# Altium schematic sheet DSR4_MODULE.SchDoc: My title
size A3; Organization: University of California; Address1: 475 Portola Plaza; Address2: Los Angeles, CA 90095; Revision: R01; SheetNumber: 1; SheetTotal: 1
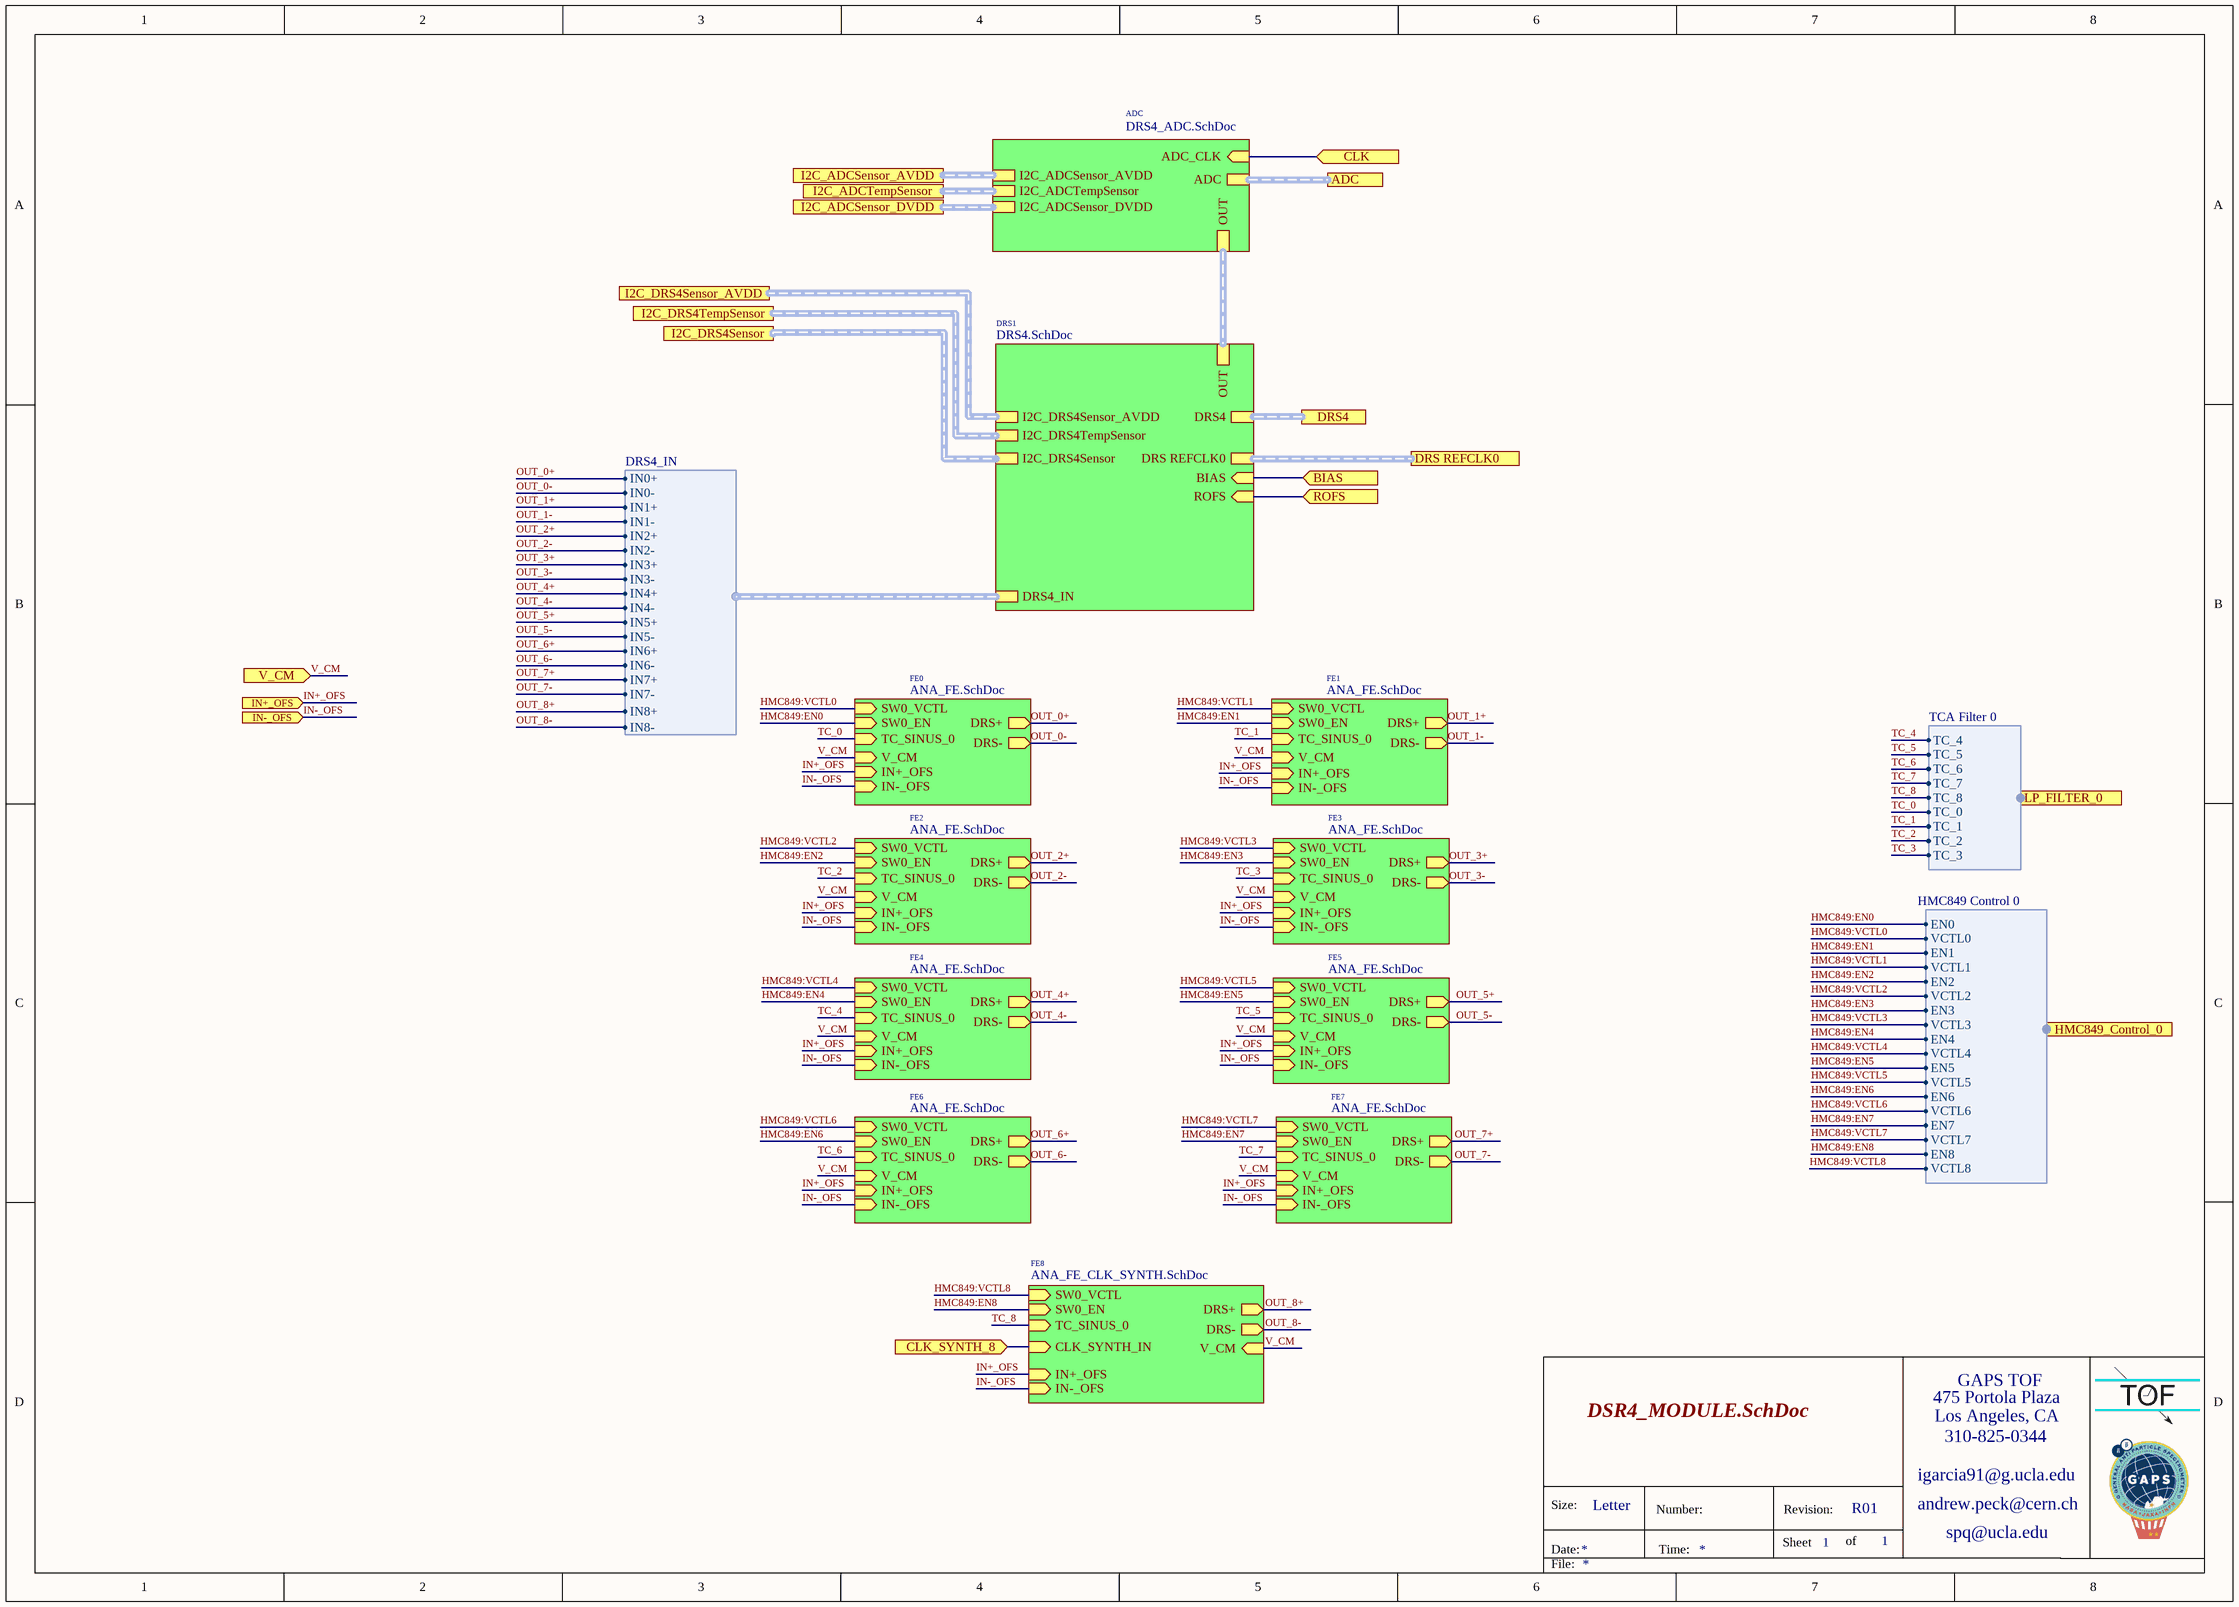
[diagram p0: DSR4_MODULE.SchDoc]

## Sub-sheets
ADC = DRS4_ADC.SchDoc: ADC (harness ADC), OUT (harness DRS4_OUT), ADC_CLK (in), I2C_ADCSensor_AVDD (harness ADC AVDD Current Sensor I2C), I2C_ADCTempSensor (harness ADC Temp Sensor I2C), I2C_ADCSensor_DVDD (harness ADC DVDD Current Sensor I2C)
DRS1 = DRS4.SchDoc: DRS4_IN (harness DRS4_IN), DRS4 (harness DRS4), OUT (harness DRS4_OUT), DRS REFCLK0 (harness DRS4 REFCLK0), BIAS (in), ROFS (in), I2C_DRS4TempSensor (harness DRS4 Temp Sensor I2C), I2C_DRS4Sensor (harness DRS4 Current Sensor I2C), I2C_DRS4Sensor_AVDD (harness DRS4 AVDD Current Sensor I2C)
FE0 = ANA_FE.SchDoc: DRS+ (out), DRS- (out), V_CM (in), SW0_VCTL (in), SW0_EN (in), TC_SINUS_0 (in), IN+_OFS (in), IN-_OFS (in)
FE1 = ANA_FE.SchDoc: DRS+ (out), DRS- (out), V_CM (in), SW0_VCTL (in), SW0_EN (in), TC_SINUS_0 (in), IN+_OFS (in), IN-_OFS (in)
FE2 = ANA_FE.SchDoc: DRS+ (out), DRS- (out), V_CM (in), SW0_VCTL (in), SW0_EN (in), TC_SINUS_0 (in), IN+_OFS (in), IN-_OFS (in)
FE3 = ANA_FE.SchDoc: DRS+ (out), DRS- (out), V_CM (in), SW0_VCTL (in), SW0_EN (in), TC_SINUS_0 (in), IN+_OFS (in), IN-_OFS (in)
FE4 = ANA_FE.SchDoc: DRS+ (out), DRS- (out), V_CM (in), SW0_VCTL (in), SW0_EN (in), TC_SINUS_0 (in), IN+_OFS (in), IN-_OFS (in)
FE5 = ANA_FE.SchDoc: DRS+ (out), DRS- (out), V_CM (in), SW0_VCTL (in), SW0_EN (in), TC_SINUS_0 (in), IN+_OFS (in), IN-_OFS (in)
FE6 = ANA_FE.SchDoc: DRS+ (out), DRS- (out), V_CM (in), SW0_VCTL (in), SW0_EN (in), TC_SINUS_0 (in), IN+_OFS (in), IN-_OFS (in)
FE7 = ANA_FE.SchDoc: DRS+ (out), DRS- (out), V_CM (in), SW0_VCTL (in), SW0_EN (in), TC_SINUS_0 (in), IN+_OFS (in), IN-_OFS (in)
FE8 = ANA_FE_CLK_SYNTH.SchDoc: DRS+ (out), DRS- (out), V_CM (in), SW0_VCTL (in), SW0_EN (in), TC_SINUS_0 (in), CLK_SYNTH_IN (in), IN+_OFS (in), IN-_OFS (in)

## Ports
ADC (harness ADC), BIAS (in), CLK (in), CLK_SYNTH_8 (in), DRS4 (harness DRS4_FPGA), DRS REFCLK0 (harness DRS4 REFCLK 0), HMC849_Control_0 (harness HMC849 Control 0), I2C_ADCSensor_AVDD (harness ADC AVDD Current Sensor I2C), I2C_ADCSensor_DVDD (harness ADC DVDD Current Sensor I2C), I2C_ADCTempSensor (harness ADC Temp Sensor I2C), I2C_DRS4Sensor (harness DRS4 Current Sensor I2C), I2C_DRS4Sensor_AVDD (harness DRS4 AVDD Current Sensor I2C), I2C_DRS4TempSensor (harness DRS4 Temp Sensor I2C), IN+_OFS (in), IN-_OFS (in), LP_FILTER_0 (harness TCA Filter 0), ROFS (in), V_CM (in)

## Harnesses
DRS4_IN: IN0+, IN0-, IN1+, IN1-, IN2+, IN2-, IN3+, IN3-, IN4+, IN4-, IN5+, IN5-, IN6+, IN6-, IN7+, IN7-, IN8+, IN8-
TCA Filter 0: TC_4, TC_5, TC_6, TC_7, TC_8, TC_0, TC_1, TC_2, TC_3
HMC849 Control 0: EN0, VCTL0, EN1, VCTL1, EN2, VCTL2, EN3, VCTL3, EN4, VCTL4, EN5, VCTL5, EN6, VCTL6, EN7, VCTL7, EN8, VCTL8

## Nets
BIAS: port BIAS, sheet DRS1/BIAS
CLK: port CLK, sheet ADC/ADC_CLK
CLK_SYNTH_8: port CLK_SYNTH_8, sheet FE8/CLK_SYNTH_IN
HMC849:EN0: sheet FE0/SW0_EN, port HMC849_Control_0.EN0
HMC849:EN1: sheet FE1/SW0_EN, port HMC849_Control_0.EN1
HMC849:EN2: sheet FE2/SW0_EN, port HMC849_Control_0.EN2
HMC849:EN3: sheet FE3/SW0_EN, port HMC849_Control_0.EN3
HMC849:EN4: sheet FE4/SW0_EN, port HMC849_Control_0.EN4
HMC849:EN5: sheet FE5/SW0_EN, port HMC849_Control_0.EN5
HMC849:EN6: sheet FE6/SW0_EN, port HMC849_Control_0.EN6
HMC849:EN7: sheet FE7/SW0_EN, port HMC849_Control_0.EN7
HMC849:EN8: sheet FE8/SW0_EN, port HMC849_Control_0.EN8
HMC849:VCTL0: sheet FE0/SW0_VCTL, port HMC849_Control_0.VCTL0
HMC849:VCTL1: sheet FE1/SW0_VCTL, port HMC849_Control_0.VCTL1
HMC849:VCTL2: sheet FE2/SW0_VCTL, port HMC849_Control_0.VCTL2
HMC849:VCTL3: sheet FE3/SW0_VCTL, port HMC849_Control_0.VCTL3
HMC849:VCTL4: sheet FE4/SW0_VCTL, port HMC849_Control_0.VCTL4
HMC849:VCTL5: sheet FE5/SW0_VCTL, port HMC849_Control_0.VCTL5
HMC849:VCTL6: sheet FE6/SW0_VCTL, port HMC849_Control_0.VCTL6
HMC849:VCTL7: sheet FE7/SW0_VCTL, port HMC849_Control_0.VCTL7
HMC849:VCTL8: sheet FE8/SW0_VCTL, port HMC849_Control_0.VCTL8
IN+_OFS: port IN+_OFS, sheet FE0/IN+_OFS, sheet FE2/IN+_OFS, sheet FE4/IN+_OFS, sheet FE6/IN+_OFS, sheet FE1/IN+_OFS, sheet FE3/IN+_OFS, sheet FE5/IN+_OFS, sheet FE7/IN+_OFS, sheet FE8/IN+_OFS
IN-_OFS: port IN-_OFS, sheet FE0/IN-_OFS, sheet FE2/IN-_OFS, sheet FE4/IN-_OFS, sheet FE6/IN-_OFS, sheet FE1/IN-_OFS, sheet FE3/IN-_OFS, sheet FE5/IN-_OFS, sheet FE7/IN-_OFS, sheet FE8/IN-_OFS
OUT_0+: sheet FE0/DRS+, sheet DRS1/DRS4_IN.IN0+
OUT_0-: sheet FE0/DRS-, sheet DRS1/DRS4_IN.IN0-
OUT_1+: sheet FE1/DRS+, sheet DRS1/DRS4_IN.IN1+
OUT_1-: sheet FE1/DRS-, sheet DRS1/DRS4_IN.IN1-
OUT_2+: sheet FE2/DRS+, sheet DRS1/DRS4_IN.IN2+
OUT_2-: sheet FE2/DRS-, sheet DRS1/DRS4_IN.IN2-
OUT_3+: sheet FE3/DRS+, sheet DRS1/DRS4_IN.IN3+
OUT_3-: sheet FE3/DRS-, sheet DRS1/DRS4_IN.IN3-
OUT_4+: sheet FE4/DRS+, sheet DRS1/DRS4_IN.IN4+
OUT_4-: sheet FE4/DRS-, sheet DRS1/DRS4_IN.IN4-
OUT_5+: sheet FE5/DRS+, sheet DRS1/DRS4_IN.IN5+
OUT_5-: sheet FE5/DRS-, sheet DRS1/DRS4_IN.IN5-
OUT_6+: sheet FE6/DRS+, sheet DRS1/DRS4_IN.IN6+
OUT_6-: sheet FE6/DRS-, sheet DRS1/DRS4_IN.IN6-
OUT_7+: sheet FE7/DRS+, sheet DRS1/DRS4_IN.IN7+
OUT_7-: sheet FE7/DRS-, sheet DRS1/DRS4_IN.IN7-
OUT_8+: sheet FE8/DRS+, sheet DRS1/DRS4_IN.IN8+
OUT_8-: sheet FE8/DRS-, sheet DRS1/DRS4_IN.IN8-
ROFS: port ROFS, sheet DRS1/ROFS
TC_0: sheet FE0/TC_SINUS_0, port LP_FILTER_0.TC_0
TC_1: sheet FE1/TC_SINUS_0, port LP_FILTER_0.TC_1
TC_2: sheet FE2/TC_SINUS_0, port LP_FILTER_0.TC_2
TC_3: sheet FE3/TC_SINUS_0, port LP_FILTER_0.TC_3
TC_4: sheet FE4/TC_SINUS_0, port LP_FILTER_0.TC_4
TC_5: sheet FE5/TC_SINUS_0, port LP_FILTER_0.TC_5
TC_6: sheet FE6/TC_SINUS_0, port LP_FILTER_0.TC_6
TC_7: sheet FE7/TC_SINUS_0, port LP_FILTER_0.TC_7
TC_8: sheet FE8/TC_SINUS_0, port LP_FILTER_0.TC_8
V_CM: port V_CM, sheet FE0/V_CM, sheet FE2/V_CM, sheet FE4/V_CM, sheet FE6/V_CM, sheet FE1/V_CM, sheet FE3/V_CM, sheet FE5/V_CM, sheet FE7/V_CM, sheet FE8/V_CM

## Buses and harness runs
harness port ADC = sheet ADC/ADC
harness port DRS4 = sheet DRS1/DRS4
harness port DRS REFCLK0 = sheet DRS1/DRS REFCLK0
harness port I2C_ADCSensor_AVDD = sheet ADC/I2C_ADCSensor_AVDD
harness port I2C_ADCSensor_DVDD = sheet ADC/I2C_ADCSensor_DVDD
harness port I2C_ADCTempSensor = sheet ADC/I2C_ADCTempSensor
harness port I2C_DRS4Sensor = sheet DRS1/I2C_DRS4Sensor
harness port I2C_DRS4Sensor_AVDD = sheet DRS1/I2C_DRS4Sensor_AVDD
harness port I2C_DRS4TempSensor = sheet DRS1/I2C_DRS4TempSensor
harness sheet ADC/OUT = sheet DRS1/OUT

## Notes on the sheet
- 475 Portola Plaza
- GAPS TOF
- igarcia91@g.ucla.edu
- Los Angeles, CA
- 310-825-0344
- Size:
- Date:
- Letter
- Number:
- Time:
- Sheet
- Revision:
- of
- andrew.peck@cern.ch
- spq@ucla.edu
- File: